# Altium schematic sheet ADC.SchDoc: ADC
size Tabloid; DocumentNumber: LM-002; Revision: F; SheetNumber: 4; SheetTotal: 4; DocumentName: LM-002
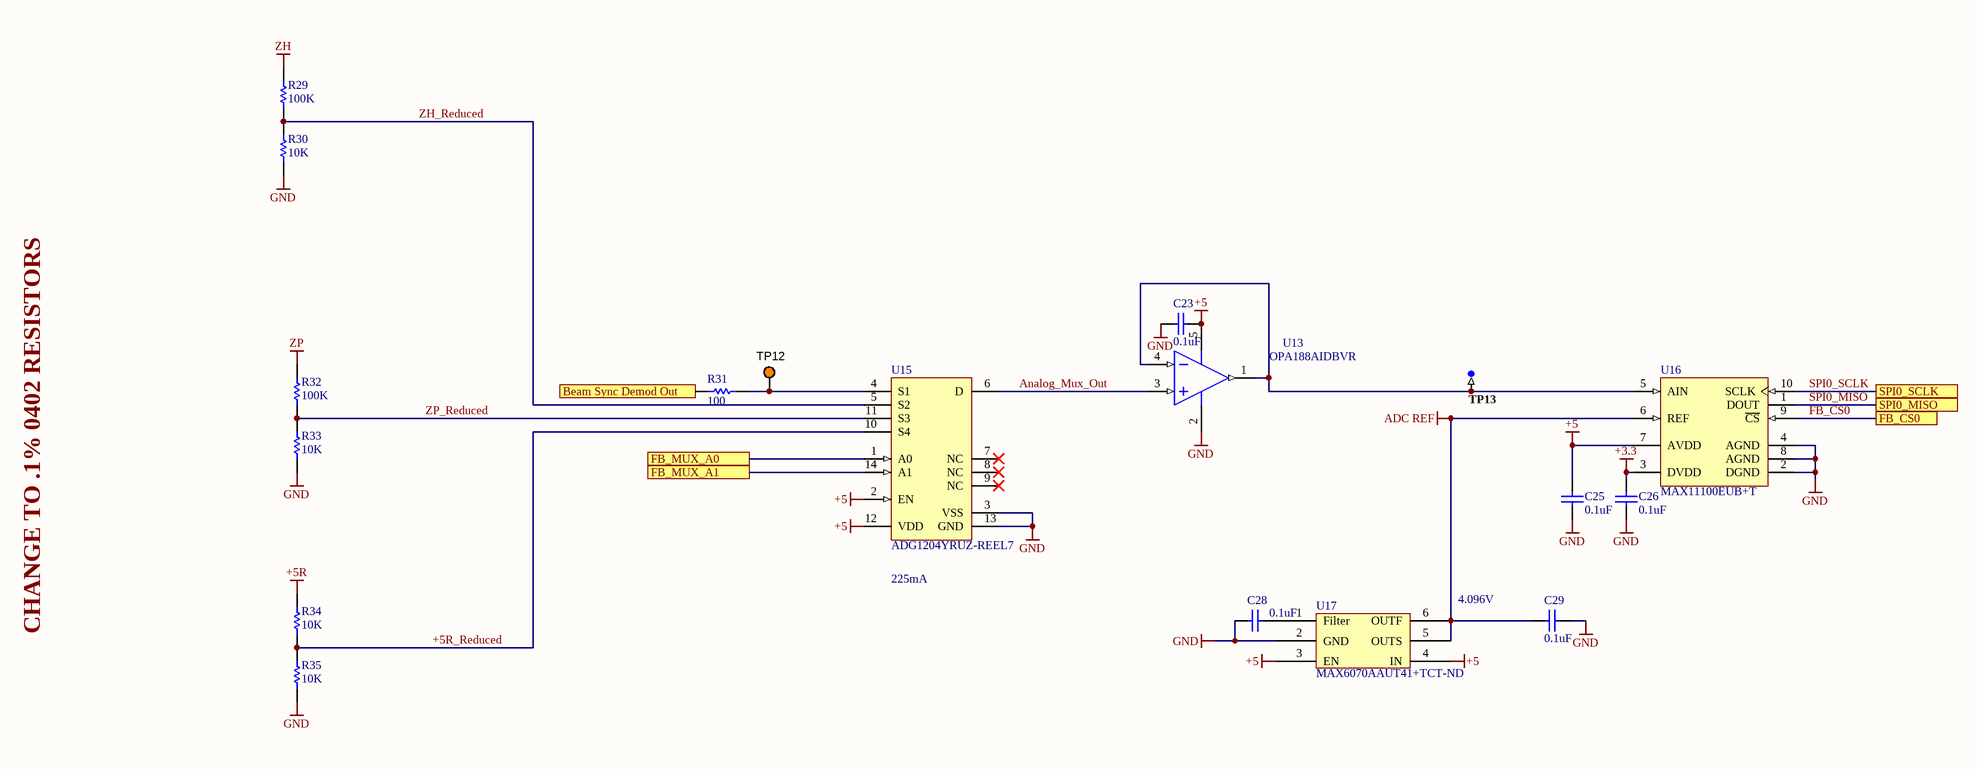
[diagram p0: ADC.SchDoc]

## Parts
C23  0.1uF  [CAPC0402(1005)60_L]
C25  0.1uF  [CAPC0402(1005)60_L]
C26  0.1uF  [CAPC0402(1005)60_L]
C28  0.1uF  [CAPC0402(1005)60_L]
C29  0.1uF  [CAPC0402(1005)60_L]
R29  100K  [RESC0805(2012)_L]
R30  10K  [RESC0805(2012)_L]
R31  100  [RESC0805(2012)_L]
R32  100K  [RESC0805(2012)_L]
R33  10K  [RESC0805(2012)_L]
R34  10K  [RESC0805(2012)_L]
R35  10K  [RESC0805(2012)_L]
TP12  5003  [KSTN-5003]  (value not drawn)
TP13  TP-SM-C-100  [TP-SM-C-100]  (value not drawn)  (no BOM)
U13  OPA188AIDBVR  [DBV0005A_M]
U15  ADG1204YRUZ-REEL7  [ADI-RU-14_L]
U16  MAX11100EUB+T  [U10+2_L]
U17  Supplier Part Number 1: MAX6070AAUT41+TCT-ND  [SOT95P280X445-6N]  (hidden comment: MAX6070AAUT41+T)

## Ports
Beam Sync Demod Out (in), FB_CS0, FB_MUX_A0, FB_MUX_A1, SPI0_MISO, SPI0_SCLK

## Nets
+3.3: C26.2 U16.3(DVDD)
+5: C23.2 C25.2 U13.5(V+) U15.2(EN) U15.12(VDD) U16.7(AVDD) U17.3(EN) U17.4(IN)
+5R: R34.2
ADC REF: C29.1 U16.6(REF) U17.5(OUTS) U17.6(OUTF)
GND: C23.1 C25.1 C26.1 C28.1 C29.2 R30.1 R33.1 R35.1 U13.2(V-) U15.3(VSS) U15.13(GND) U16.2(DGND) U16.4(AGND) U16.8(AGND) U17.2(GND)
ZH: R29.2
ZP: R32.2
+5R_Reduced: R34.1 R35.2 U15.10(S4)
Analog_Mux_Out: U13.3(IN+) U15.6(D)
Beam Sync Demod Out: R31.2 ; port Beam Sync Demod Out
FB_CS0: U16.9(~{CS}) ; port FB_CS0
FB_MUX_A0: U15.1(A0) ; port FB_MUX_A0
FB_MUX_A1: U15.14(A1) ; port FB_MUX_A1
SPI0_MISO: U16.1(DOUT) ; port SPI0_MISO
SPI0_SCLK: U16.10(SCLK) ; port SPI0_SCLK
ZH_Reduced: R29.1 R30.2 U15.5(S2)
ZP_Reduced: R32.1 R33.2 U15.11(S3)
NetC28_2: C28.2 U17.1(Filter)
NetR31_1: R31.1 TP12.1 U15.4(S1)
NetTP13_1: TP13.1 U13.1(OUT) U13.4(IN-) U16.5(AIN)

Not connected (* = marked no-connect by the designer): U15 7(NC)* 8(NC)* 9(NC)*

## Notes on the sheet
- (near U15) 225mA
- 4.096V
- CHANGE TO .1% 0402 RESISTORS
- Title
- Size:
- Date:
- Tabloid
- Number:
- Time:
- Revision:
- Sheet
- of
- ZLS Corporation
- 7801 North Lamar Blvd.
- Suite E-184
- Austin, Texas 78752  USA
- (512) 453-0288
- File:

## Library data of the parts
C23 C25 C26 C28 C29 = CMP-1034-00252-1: CAP CER 0.1UF 10V X7R 0402; Manufacturer: Murata Electronics North America; Manufacturer Part Number: GRM155R71A104KA01D; Tolerance: ±10%; Supplier 1: Digi-Key; Supplier Part Number 1: 490-6321-1-ND; RoHS: RoHS Compliant; Category: Capacitors; Stock 1: 2920395; Pricing 1: 1=0.1, 10=0.014, 100=0.0063, 500=0.00446, 1000=0.00351, 2500=0.00319, 5000=0.00293 (USD); Packaging: Cut Tape (CT); Part Status: Active; Voltage - Rated: 10V; Temperature Coefficient: X7R; Operating Temperature: -55°C ~ 125°C; Features: -; Ratings: -; Applications: General Purpose; Mounting Type: Surface Mount, MLCC; Package / Case: 0402 (1005 Metric); Size / Dimension: 0.039" L x 0.020" W (1.00mm x 0.50mm); Height - Seated (Max): -; Thickness (Max): 0.022" (0.55mm); Lead Spacing: -; ComponentLink1URL: http://www.murata.com/~/media/webrenewal/support/library/catalog/products/capacitor/mlcc/c02e.ashx?la=en-us; ComponentLink1Description: http://www.murata.com/~/media/webrenewal/support/library/catalog/products/capacitor/mlcc/c02e.ashx?la=en-us
R29 R32 = CMP-1013-00215-1: RES SMD 100K OHM 1% 1/8W 0805; Manufacturer: Vishay Dale; Manufacturer Part Number: RCA0805100KFKEA; Power (Watts): 0.125W, 1/8W; Temperature Coefficient: ±100ppm/°C; Supplier 1: Digi-Key; Supplier Part Number 1: 541-2230-1-ND; RoHS: RoHS Compliant; Category: Resistors; Stock 1: 18704; Pricing 1: 1=0.1, 10=0.079, 100=0.0303, 1000=0.01331, 2500=0.0115 (USD); Packaging: Cut Tape (CT); Part Status: Active; Tolerance: ±1%; Composition: Thick Film; Features: Anti-Sulfur, Automotive AEC-Q200; Operating Temperature: -55°C ~ 155°C; Package / Case: 0805 (2012 Metric); Supplier Device Package: 0805; Size / Dimension: 0.079" L x 0.049" W (2.01mm x 1.25mm); Height - Seated (Max): 0.020" (0.50mm); Failure Rate: -; ComponentLink1URL: http://www.vishay.com/docs/20037/rcae3.pdf; ComponentLink1Description: http://www.vishay.com/docs/20037/rcae3.pdf
R30 R33-R35 = CMP-1013-00215-1: RES SMD 10K OHM 1% 1/8W 0805; Manufacturer: Vishay Dale; Manufacturer Part Number: CRCW080510K0FKEA; Power (Watts): 0.125W, 1/8W; Temperature Coefficient: ±100ppm/°C; Supplier 1: Digi-Key; Supplier Part Number 1: 541-10.0KCCT-ND; RoHS: RoHS Compliant; Category: Resistors; Stock 1: 1104982; Pricing 1: 1=0.1, 10=0.055, 100=0.0223, 1000=0.01003, 2500=0.0087 (USD); Packaging: Cut Tape (CT); Part Status: Active; Tolerance: ±1%; Composition: Thick Film; Features: Automotive AEC-Q200; Operating Temperature: -55°C ~ 155°C; Package / Case: 0805 (2012 Metric); Supplier Device Package: 0805; Size / Dimension: 0.079" L x 0.049" W (2.00mm x 1.25mm); Height - Seated (Max): 0.020" (0.50mm); Failure Rate: -; ComponentLink1URL: http://www.vishay.com/docs/20035/dcrcwe3.pdf; ComponentLink1Description: http://www.vishay.com/docs/20035/dcrcwe3.pdf
R31 = CMP-1013-00215-1: RES SMD 100 OHM 1% 1/8W 0805
TP12 = CMP-1672-00009-1: Test Point, Orange, 1-Pin THD, RoHS; Peak Reverse Current: 600 uA; Forward Current: 3 A; Max Surge Current: 80 A; Forward Voltage: 1.08 V; Max Operating Temperature: 150 degC; PackageReference: 5003; Pins: 2; ComponentLink2URL: http://keyelco.com/userAssets/file/M65p56.pdf; PackageDescription: 1-Pin Through Hole Device, Dia 2.54 mm; Weight: 0.01 lb; Diameter: 5.3 mm; Mount: Through Hole; Package Quantity: 500; Packaging: Bulk; Min Operating Temperature: -65 degC; ComponentLink1Description: Manufacturer URL; Height: 0.25 inch; ComponentLink1URL: http://www.keyelco.com/; ComponentLink2Description: Datasheet; Width: 0.25 inch; REACH SVHC: No SVHC; RoHSCompliant: true; Radiation Hardening: No; Length: 9.5 mm; DatasheetVersion: Jun-15
TP13 = CMP-0484-00002-2: Test Point, Surface Mount, Circular, Pad Diameter 1 mm; Manufacturer: No Vendor; PartNumber: TP-SM-C-100
U13 = CMP-0809-00005-2: Precision, Low Noise, Rail-to-Rail Output, Zero-Drift Operational Amplifier, 4 to 36 V, -40 to 125 degC, 5-pin SOT23 (DBV5), Green (RoHS & no Sb/Br); Manufacturer: Texas Instruments; Unity Gain Bandwidth Product: 2MHz; Max Supply Voltage: 36V; Min Supply Voltage: 4V; Min Dual Supply Voltage: 2V; Max Dual Supply Voltage: 18V; Nominal Supply Current: 510uA; Common Mode Rejection Ratio: 120dB; Number of Channels: 1; Slew Rate: 0.8V/µs; Input Bias Current: 160pA; Input Offset Voltage (Vos): 6uV; Operating Supply Current: 450uA; Output Current per Channel: 18mA; Voltage Gain: 136dB; Input Voltage Noise Density: 8.8nV/sqrt Hz; Power Supply Rejection Ratio (PSRR): 142dB; Supplier 1: Arrow; Supplier Part Number 1: OPA188AIDBVR; Manufacturer Part Number: OPA188AIDBVR; Stock 1: 95; Pricing 1: 1=2.1871, 10=1.943, 25=1.9086, 100=1.5565, 250=1.5371, 500=1.3168, 1000=1.2243 (USD); Case/Package: SOT-23-5; Number of Pins: 5; Contact Plating: Nickel,Gold; Min Operating Temperature: -40°C; Max Operating Temperature: 125°C; Packaging: Tape and Reel; Package Quantity: 3000; Nominal Gain Bandwidth Product: 2MHz; Number of Circuits: 1; Gain Bandwidth Product: 2MHz; Number of Elements: 1; Lead Free: Lead Free; ComponentLink1URL: https://datasheet.ciiva.com/24017/opa188-372986-24017253.pdf; ComponentLink1Description: https://datasheet.ciiva.com/24017/opa188-372986-24017253.pdf; ComponentLink2URL: https://datasheet.ciiva.com/18622/opa188-18622375.pdf; ComponentLink2Description: https://datasheet.ciiva.com/18622/opa188-18622375.pdf
U15 = CMP-0793-00109-1: Low Capacitance, Low Charge Injection, +/-15 V / +12 V, 4:1 iCMOS Multiplexer, 120 Ohm Ron, 14-pin SOP (RU-14), Reel; Manufacturer: Maxim Integrated; Manufacturer Part Number: MAX11100EUB+; Number of Bits: 16; Sampling Rate (Per Second): 200k; Number of Inputs: 1; Input Type: Single Ended; Data Interface: SPI; Configuration: S/H-ADC; Ratio - S/H:ADC: 1:1; Architecture: SAR; Reference Type: External; Voltage - Supply, Analog: 5V; Voltage - Supply, Digital: 2.7 V ~ 5.25 V; Supplier 1: Digi-Key; Supplier Part Number 1: MAX11100EUB+-ND; RoHS: RoHS Compliant; Category: Integrated Circuits (ICs); Stock 1: 927; Pricing 1: 1=5.98, 10=5.855 (USD); Packaging: Tube; Part Status: Active; Features: -; Operating Temperature: -40°C ~ 85°C; Package / Case: 10-TFSOP, 10-MSOP (0.118", 3.00mm Width); Supplier Device Package: 10-uMAX; Base Part Number: MAX11100; ComponentLink1URL: https://datasheets.maximintegrated.com/en/ds/MAX11100.pdf; ComponentLink1Description: https://datasheets.maximintegrated.com/en/ds/MAX11100.pdf
U16 = CMP-0249-00017-1: 16-Bit, +5V, 200ksps ADC with 10uA Shutdown, 10-Pin uMAX, -40°C to +85°C, Pb-Free, Tape and Reel; Manufacturer: Maxim Integrated; Number of Bits: 16; Sampling Rate (Per Second): 200k; Number of Inputs: 1; Input Type: Single Ended; Data Interface: SPI; Configuration: S/H-ADC; Ratio - S/H:ADC: 1:1; Architecture: SAR; Reference Type: External; Voltage - Supply, Analog: 5V; Voltage - Supply, Digital: 2.7 V ~ 5.25 V; Supplier 1: Digi-Key; Supplier Part Number 1: MAX11100EUB+-ND; Manufacturer Part Number: MAX11100EUB+; RoHS: RoHS Compliant; Category: Integrated Circuits (ICs); Stock 1: 927; Pricing 1: 1=5.98, 10=5.855 (USD); Packaging: Tube; Part Status: Active; Features: -; Operating Temperature: -40°C ~ 85°C; Package / Case: 10-TFSOP, 10-MSOP (0.118", 3.00mm Width); Supplier Device Package: 10-uMAX; Base Part Number: MAX11100; ComponentLink1URL: https://datasheets.maximintegrated.com/en/ds/MAX11100.pdf; ComponentLink1Description: https://datasheets.maximintegrated.com/en/ds/MAX11100.pdf
U17 = MAX6070AAUT41+T: IC VREF SERIES 4.096V SOT23; Manufacturer: Maxim Integrated; Output Type: Fixed; Tolerance: ±0.04%; Temperature Coefficient: 6ppm/°C; Noise - 0.1Hz to 10Hz: 9.6µVp-p; Noise - 10Hz to 10kHz: 9µVrms; Voltage - Input: 4.3 V ~ 5.5 V; Current - Supply: 350µA; Supplier 1: Digi-Key; Manufacturer Part Number: MAX6070AAUT41+T; RoHS: RoHS Compliant; Category: Integrated Circuits (ICs); Stock 1: 2623; Pricing 1: 1=3.41, 10=3.213, 25=2.5704, 50=2.4418, 100=2.2491, 250=2.13344, 500=2.05634 (USD); Packaging: Cut Tape (CT); Part Status: Active; Reference Type: Series; Voltage - Output (Min/Fixed): 4.096V; Operating Temperature: -40°C ~ 125°C (TA); Mounting Type: Surface Mount; Package / Case: SOT-23-6; Supplier Device Package: SOT-23-6; ComponentLink1URL: https://datasheets.maximintegrated.com/en/ds/MAX6070-MAX6071.pdf; ComponentLink1Description: https://datasheets.maximintegrated.com/en/ds/MAX6070-MAX6071.pdf